# EAGLE schematic controller_print (EAGLE 6.1)
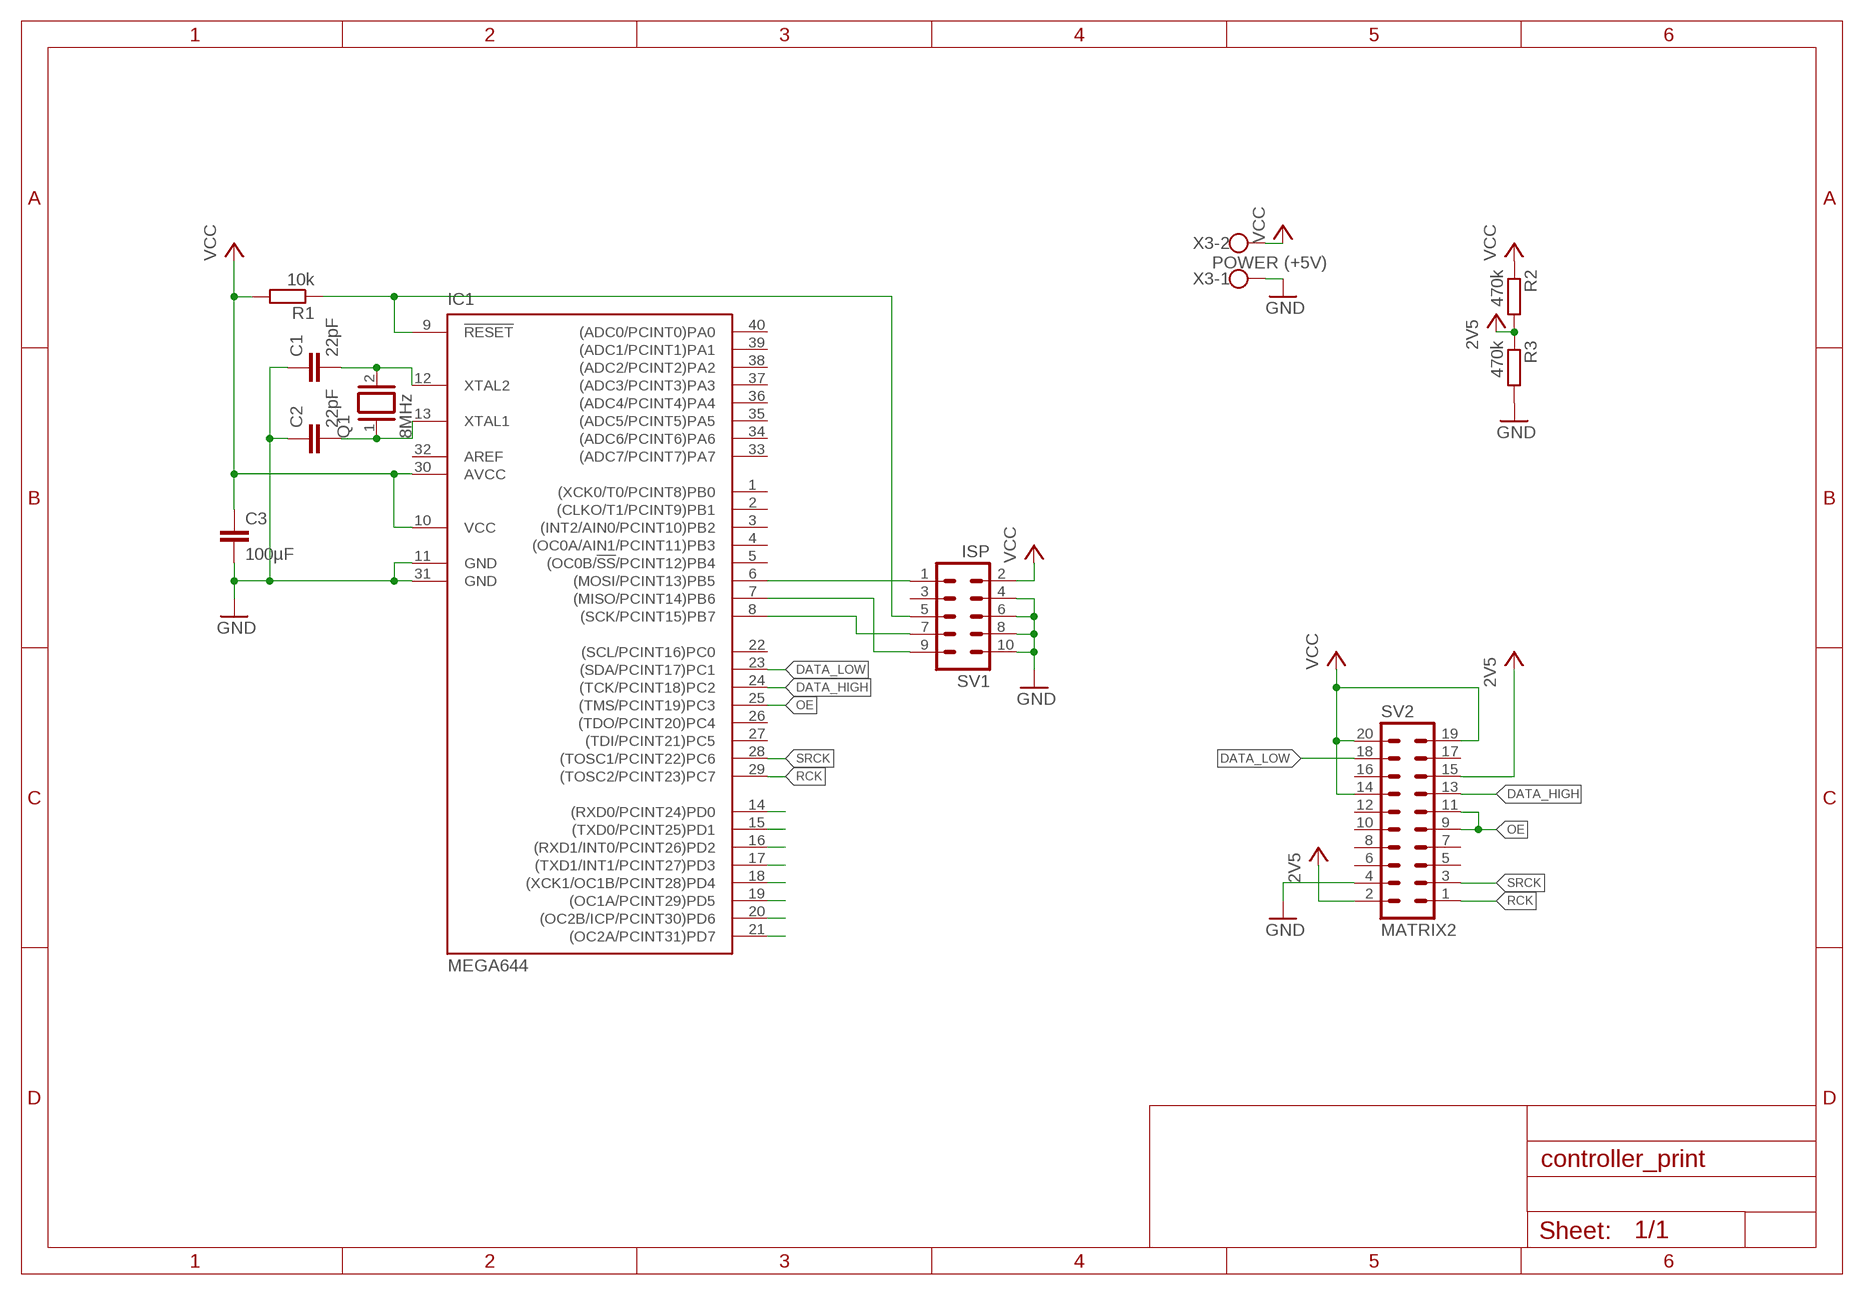
[diagram p0: schematic, sheet 1]

## Parts
C1  22pF  C-EU050-024X044  [C050-024X044]
C2  22pF  C-EU050-024X044  [C050-024X044]
C3  100µF  C-EU050-030X075  [C050-030X075]
IC1  MEGA644  MEGA164P/324P/644P-PU  [DIL40]
Q1  8MHz  XTAL/S  [QS]
R1  10k  R-EU_0207/10  [0207/10]
R2  470k  R-EU_0207/10  [0207/10]
R3  470k  R-EU_0207/10  [0207/10]
SV1  ISP  ML10  [ML10]
SV2  MATRIX2  ML20  [ML20]
X3  POWER (+5V)  W237-102  [W237-102]

## Nets
+3V3: R2.2 R3.1 SV2.2 SV2.15 ; supply symbol labelled 2V5
DATA_HIGH: IC1.24((TCK/PCINT18)PC2) SV2.13
DATA_LOW: IC1.23((SDA/PCINT17)PC1) SV2.18
GND: C1.1 C2.1 C3.2 IC1.11(GND) IC1.31(GND) R3.2 SV1.4 SV1.6 SV1.8 SV1.10 SV2.4 X3.1
MOSI: IC1.6((MOSI/PCINT13)PB5) SV1.1
N$2: C2.2 IC1.13(XTAL1) Q1.1
N$3: C1.2 IC1.12(XTAL2) Q1.2
N$4: IC1.9(!RESET) R1.1 SV1.5
N$5: IC1.14((RXD0/PCINT24)PD0)
N$6: IC1.7((MISO/PCINT14)PB6) SV1.9
N$7: IC1.15((TXD0/PCINT25)PD1)
N$8: IC1.16((RXD1/INT0/PCINT26)PD2)
N$9: IC1.17((TXD1/INT1/PCINT27)PD3)
N$10: IC1.18((XCK1/OC1B/PCINT28)PD4)
N$11: IC1.19((OC1A/PCINT29)PD5)
N$12: IC1.20((OC2B/ICP/PCINT30)PD6)
N$13: IC1.21((OC2A/PCINT31)PD7)
OE: IC1.25((TMS/PCINT19)PC3) SV2.9 SV2.11
RCK: IC1.29((TOSC2/PCINT23)PC7) SV2.1
SCK: IC1.8((SCK/PCINT15)PB7) SV1.7
SRCK: IC1.28((TOSC1/PCINT22)PC6) SV2.3
VCC: C3.1 IC1.10(VCC) IC1.30(AVCC) R1.2 R2.1 SV1.2 SV2.14 SV2.19 SV2.20 X3.2
Unconnected: IC1.1((XCK0/T0/PCINT8)PB0) IC1.2((CLKO/T1/PCINT9)PB1) IC1.3((INT2/AIN0/PCINT10)PB2) IC1.4((OC0A/AIN1/PCINT11)PB3) IC1.5((OC0B/!SS!/PCINT12)PB4) IC1.22((SCL/PCINT16)PC0) IC1.26((TDO/PCINT20)PC4) IC1.27((TDI/PCINT21)PC5) IC1.33((ADC7/PCINT7)PA7) IC1.34((ADC6/PCINT6)PA6) IC1.35((ADC5/PCINT5)PA5) IC1.36((ADC4/PCINT4)PA4) IC1.37((ADC3/PCINT3)PA3) IC1.38((ADC2/PCINT2)PA2) IC1.39((ADC1/PCINT1)PA1) IC1.40((ADC0/PCINT0)PA0) SV1.3 SV2.5 SV2.6 SV2.7 SV2.8 SV2.10 SV2.12 SV2.16 SV2.17

## Power pins joined to a net without a drawn wire
AREF: IC1.32(AREF)

## Library data of the parts
C1-C3 = resistor:C-EU: CAPACITOR, European symbol
IC1 = avr-5:MEGA164P/324P/644P-PU
Q1 = special:XTAL/S: CRYSTAL
R1-R3 = resistor:R-EU_: RESISTOR, European symbol
SV1 = con-ml:ML10: HARTING; OC_FARNELL: unknown; OC_NEWARK: unknown
SV2 = con-ml:ML20: HARTING; OC_FARNELL: unknown; OC_NEWARK: unknown
X3 = con-wago-500:W237-102: WAGO SCREW CLAMP; MPN: 237-102; OC_FARNELL: unknown; OC_NEWARK: 70K9898